# EAGLE design UT-61E_MOD (EAGLE 7.1.0)
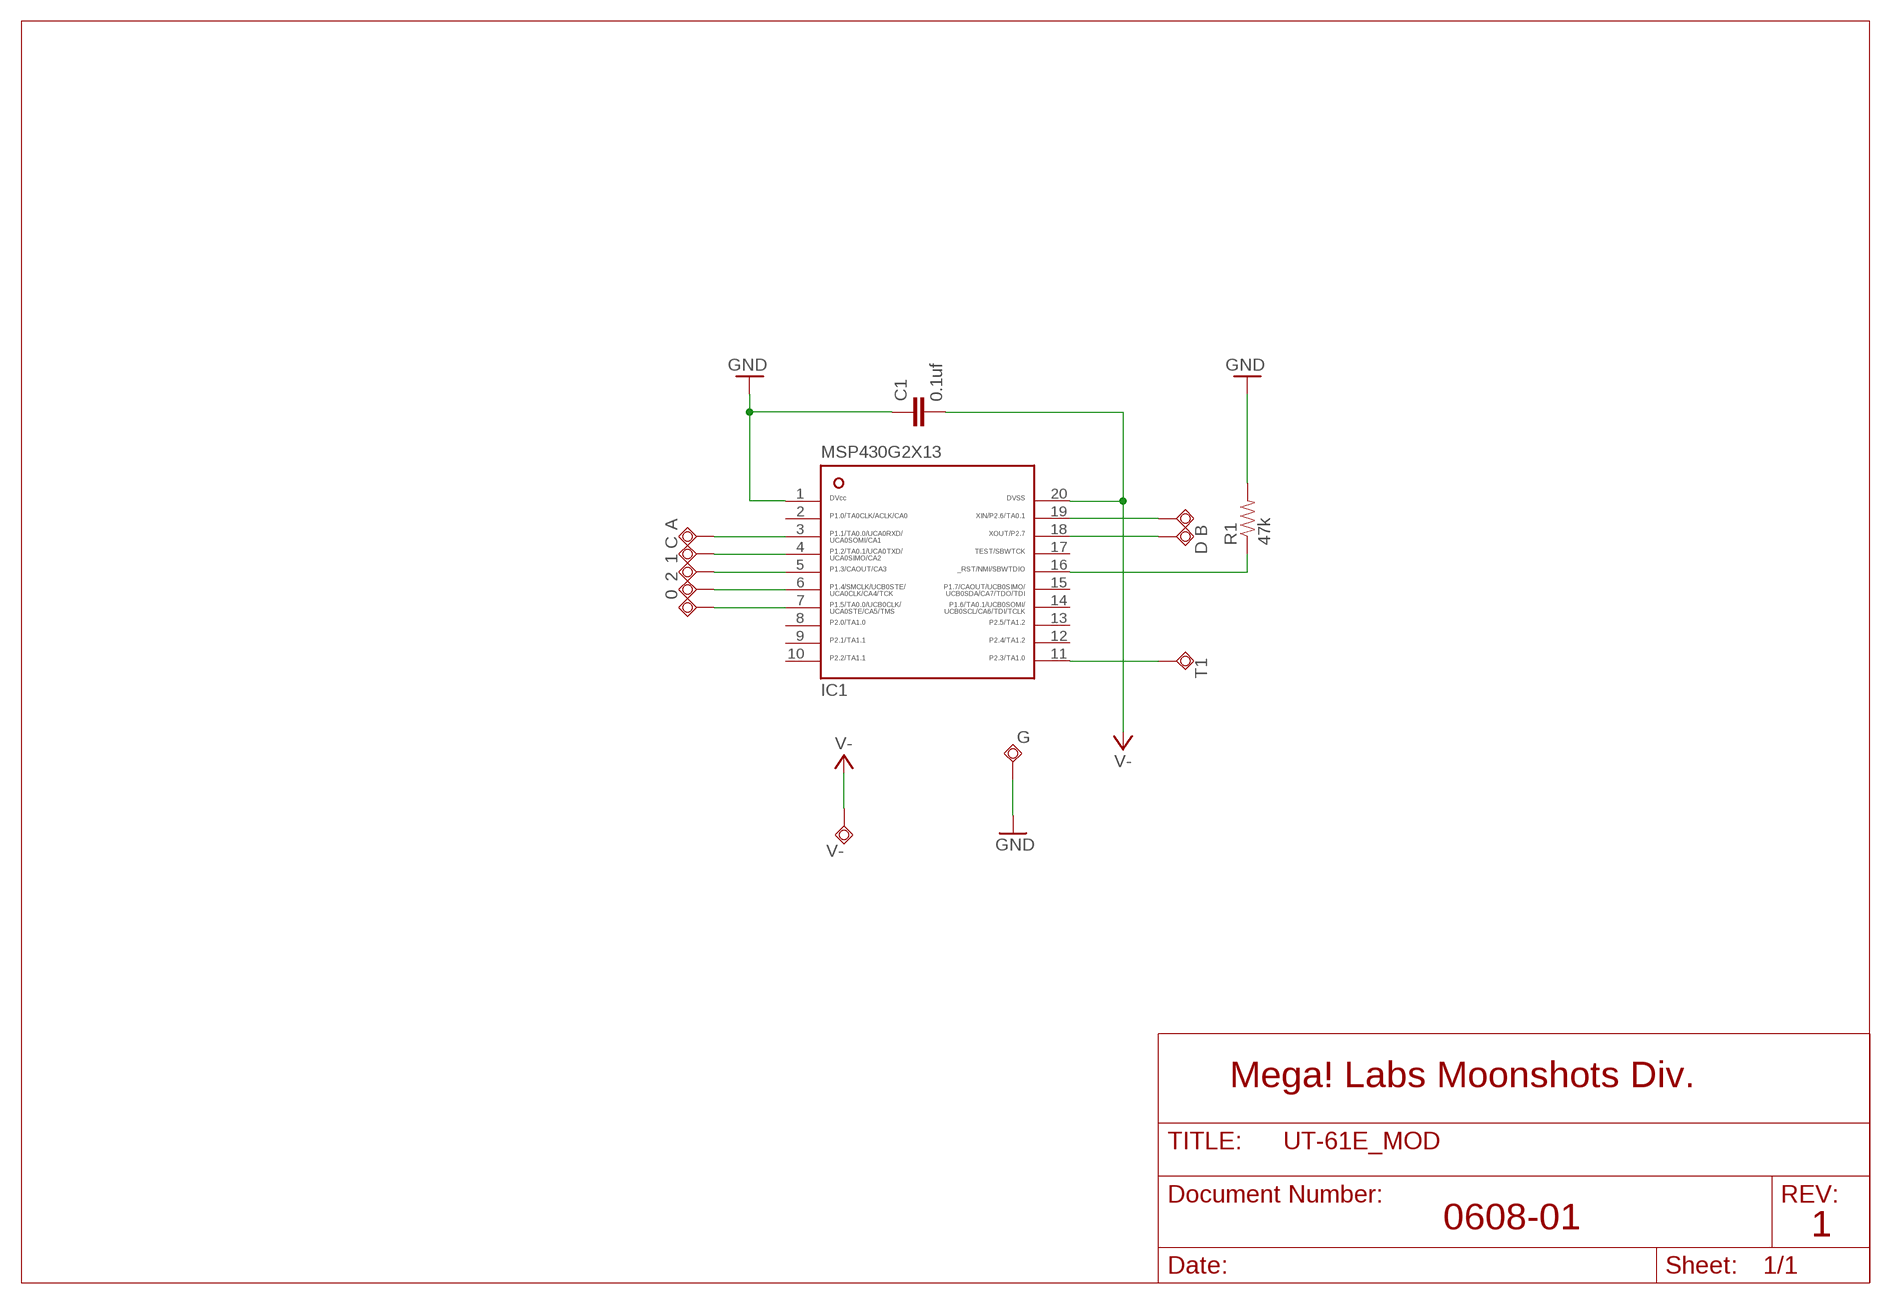
[diagram p0: schematic, sheet 1]

## Parts
0  TPSQTP18SQ  [TP18SQ]
1  TPSQTP18SQ  [TP18SQ]
2  TPSQTP18SQ  [TP18SQ]
A  TPSQTP18SQ  [TP18SQ]
B  TPSQTP18SQ  [TP18SQ]
C  TPSQTP18SQ  [TP18SQ]
C1  0.1uf  CAP0805  [0805]
D  TPSQTP18SQ  [TP18SQ]
G  TPSQTP18SQ  [TP18SQ]
IC1  MSP430G2X13-20PW20  [PW20]
R1  47k  RESISTOR0805-RES  [0805]
T1  TPSQTP18SQ  [TP18SQ]
V-  TPSQTP18SQ  [TP18SQ]

## Nets
GND: C1.1 G.TP IC1.1 R1.2
N$1: B.TP IC1.19
N$2: A.TP IC1.3
N$3: C.TP IC1.4
N$4: D.TP IC1.18
N$5: IC1.16 R1.1
N$6: 1.TP IC1.5
N$7: 2.TP IC1.6
N$8: 0.TP IC1.7
N$9: IC1.11 T1.TP
V-: C1.2 IC1.20 V-.TP
Unconnected: IC1.2 IC1.8 IC1.9 IC1.10 IC1.12 IC1.13 IC1.14 IC1.15 IC1.17

## Notes on the sheet
- Mega! Labs Moonshots Div.
- 0608-01 | 1

## Library data of the parts
0 1 2 A B C D G T1 V- = testpad:TPSQ: Test pad
C1 = SparkFun-Passives:CAP: Capacitor Standard 0603 ceramic capacitor, and 0.1" leaded capacitor.
IC1 = ti_msp430:MSP430G2X13-20
R1 = SparkFun-Passives:RESISTOR: Resistor Basic schematic elements and footprints for 0603, 1206, and PTH resistors.

## Board
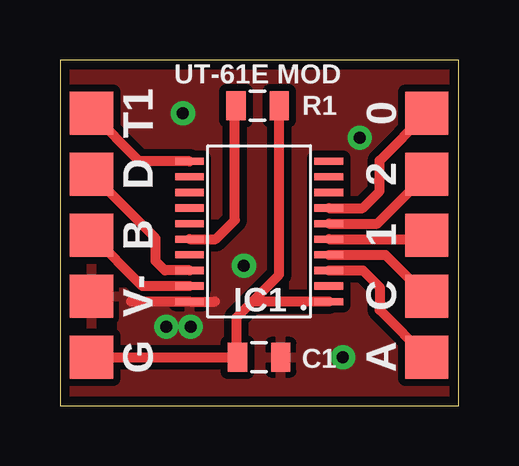
[diagram p1: board, top side]
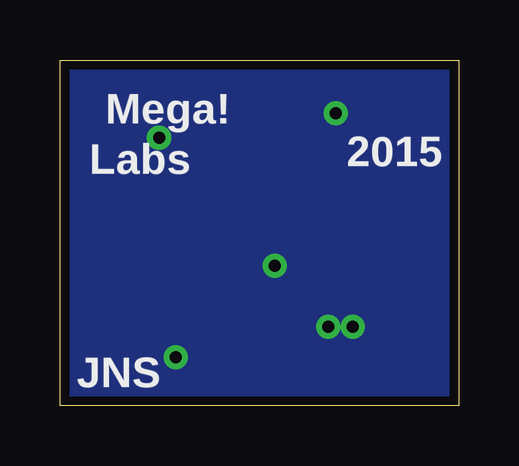
[diagram p2: board, bottom side, seen from below]

Size 16.62 x 14.4 mm. Coordinates in mm from the lower left corner, seen from the top.
Outline: 16.62,14.4 0,14.4 0,0 16.62,0 16.62,14.4
Copper layers (1*16): Top 0.0356mm / dielectric 1.5011mm / Bottom 0.0356mm
Design rules "LaenPCBOrder *": minimum track width 6mil, minimum drill 13mil, track to track 6mil, track to pad 6mil, pad to pad 6mil, via to via 6mil, smd to smd 6mil, copper to edge 15mil, drill to drill 6mil, minimum pad ring 7mil, minimum via ring 10mil, stop-mask expansion 3mil, vias tented up to drill 1.3mm, thermal gap 10mil

### Footprints (pad centres in the part's own frame; a part is rotated, then mirrored left to right if it is on the bottom)
TP18SQ = smd 1.8 x 1.8: TP 0,0
0805 = smd 0.8 x 1.2: 1 -0.9,0; 2 0.9,0
PW20 = smd 0.3 x 1.2: 1 -2.925,-2.9; 2 -2.275,-2.9; 3 -1.625,-2.9; 4 -0.975,-2.9; 5 -0.325,-2.9; 6 0.325,-2.9; 7 0.975,-2.9; 8 1.625,-2.9; 9 2.275,-2.9; 10 2.925,-2.9; 11 2.925,2.9; 12 2.275,2.9; 13 1.625,2.9; 14 0.975,2.9; 15 0.325,2.9; 16 -0.325,2.9; 17 -0.975,2.9; 18 -1.625,2.9; 19 -2.275,2.9; 20 -2.925,2.9

### Placement (x,y rotation side)
0  15.28,12.18 90 top
1  15.28,7.1 90 top
2  15.28,9.64 90 top
A  15.28,2.02 90 top
B  1.31,7.1 270 top
C  15.28,4.56 90 top
C1  8.3,2.02 0 top
D  1.31,9.64 270 top
G  1.31,2.02 270 top
IC1  8.3,7.26 90 top
R1  8.23,12.5 0 top
T1  1.31,12.18 270 top
V-  1.31,4.56 270 top

### Tracks (layer width: path | path; a pad name or v marks a point on that pad's centre or on a via)
GND
  Top 0.406: IC1.1 8.01,4.33 | 8.01,4.33 7.35,3.67 7.35,2.02 C1.1 G.TP | 8.01,4.33 9.13,5.46 R1.2
N$1
  Top 0.406: IC1.19 3.43,4.98 B.TP
N$2
  Top 0.406: IC1.3 12.62,5.63 13.31,4.94 13.31,3.99 A.TP
N$3
  Top 0.406: IC1.4 13.56,6.28 C.TP
N$4
  Top 0.406: IC1.18 4.37,5.63 3.98,6.02 3.98,6.97 D.TP
N$5
  Top 0.406: IC1.16 6.48,6.93 7.28,7.73 7.28,12.49 R1.1
N$6
  Top 0.406: IC1.5 15.12,6.93 1.TP
N$7
  Top 0.406: IC1.6 13.23,7.58 2.TP
N$8
  Top 0.406: IC1.7 12.61,8.23 13.31,8.94 13.31,10.21 0.TP
N$9
  Top 0.406: T1.TP 3.31,10.18 IC1.11
V-  (via drill 0.5)
  Top 0.406: 6.46,4.33 IC1.20 2.96,4.33
  other vias: 11.79,2.02 12.49,11.16 5.12,12.18 4.43,3.29 7.66,5.83 5.44,3.29
  pour Top (isolate 0.305): 16.62,-0.01 16.62,14.4 -0.02,14.4 -0.02,-0.01
  pour Bottom (isolate 0.305): 16.62,-0.01 16.62,14.4 -0.02,14.4 -0.02,-0.01

### Text on the board
tNames: UT-61E MOD
bNames: Mega! | 2015 | Labs | JNS